# Altium schematic sheet SH21 - JTAG CONNECTOR.SchDoc
size 386 x 246 mm
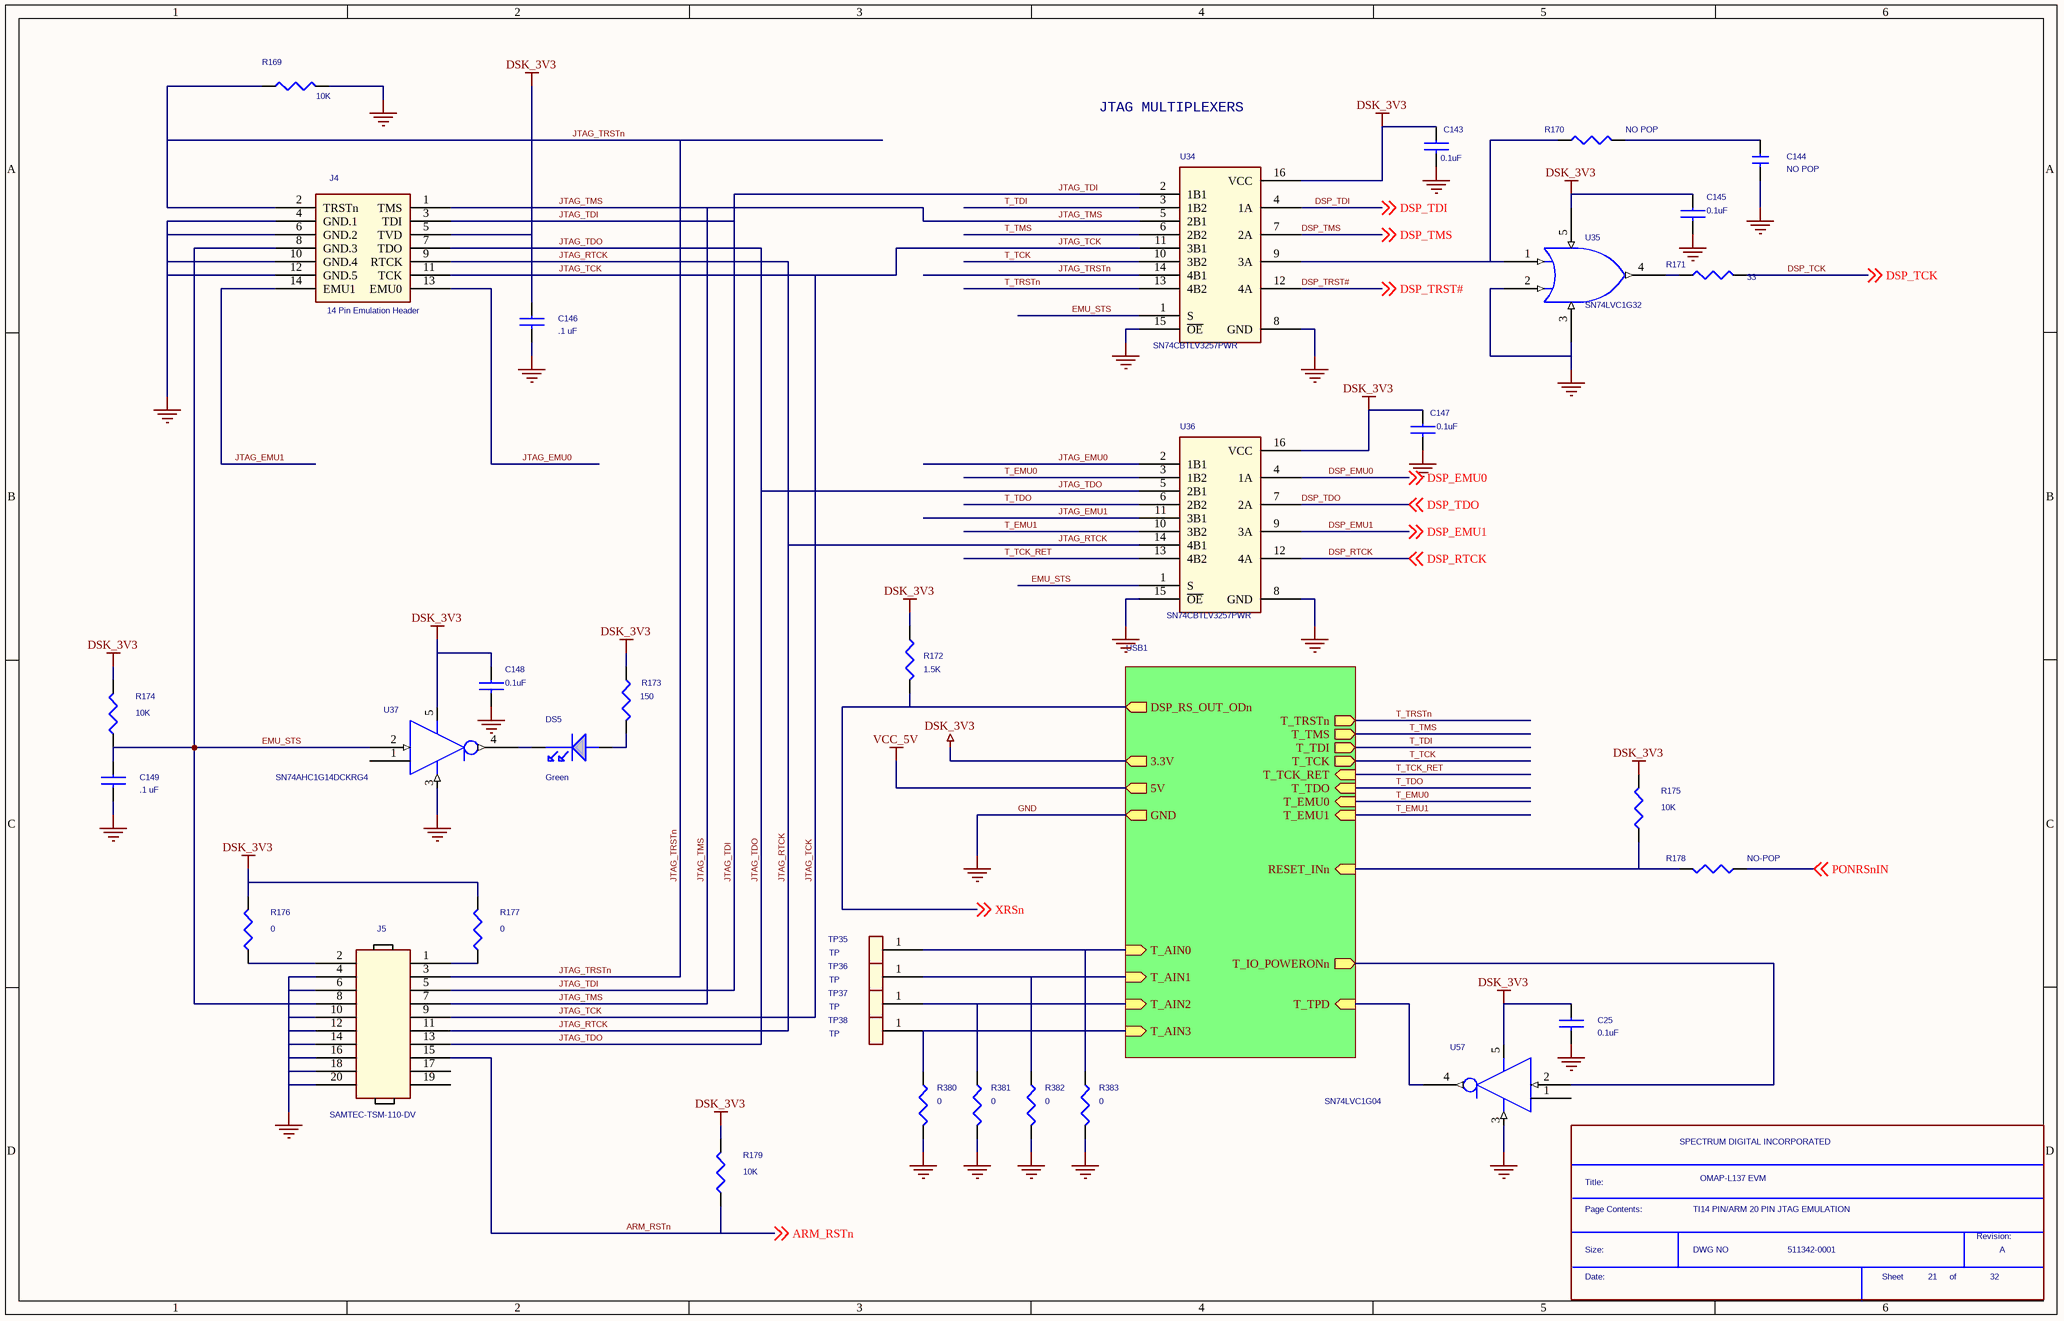
[diagram p0: SH21 - JTAG CONNECTOR.SchDoc]

## Parts
*  Page Contents:: TI14 PIN/ARM 20 PIN JTAG EMULATION  RevCode: A  Title: OMAP-L137 EVM  OrgName: SPECTRUM DIGITAL INCORPORATED  Doc: 511342-0001  Page Number: 21  Page Count: 32  (hidden comment: SDTitleBlock)  (graphical)
C25  0.1uF  [c402-25]
C143  0.1uF  [c402-25]
C144  NO POP  [c402-25]
C145  0.1uF  [c402-25]
C146  .1 uF  [c402-25]
C147  0.1uF  [c402-25]
C148  0.1uF  [c402-25]
C149  .1 uF  [c402-25]
DS5  Green  [CHIP 1206]
J4  14 Pin Emulation Header  [JUMP2X7-6040]
J5  SAMTEC-TSM-110-DV  [JUMP2X10-6040]
R169  10K  [r402-25]
R170  NO POP  [r603-35X45]
R171  33  [r402-25]
R172  1.5K  [r603-35x45]
R173  150  [r603-35x45]
R174  10K  [r402-25]
R175  10K  [r402-25]
R176  0  [r402-25]
R177  0  [r402-25]
R178  NO-POP  [r402-25]
R179  10K  [r402-25]
R380  0  [r402-25]
R381  0  [r402-25]
R382  0  [r402-25]
R383  0  [r402-25]
TP35  TP  [tp1-6040]
TP36  TP  [tp1-6040]
TP37  TP  [tp1-6040]
TP38  TP  [tp1-6040]
U34  SN74CBTLV3257PWR  [TSSOP 16]
U35  SN74LVC1G32  [SO5]
U36  SN74CBTLV3257PWR  [TSSOP 16]
U37  SN74AHC1G14DCKRG4  [DCK]
U57  SN74LVC1G04  [DCK]

## Sub-sheets
USB1 = ?: GND (out), 3.3V (out), T_TCK_RET (in), T_TCK (out), T_TMS (out), T_TDI (out), T_TDO (in), T_EMU0 (in), T_EMU1 (in), T_TRSTn (out), DSP_RS_OUT_ODn (out), RESET_INn (in), 5V (out), T_IO_POWERONn (out), T_TPD (in), T_AIN0 (in), T_AIN1 (in), T_AIN2 (in), T_AIN3 (in)

## Nets
DSK_3V3: C25.1 C143.1 C145.1 C146.1 C147.1 C148.1 J4.5(TVD) R172.1 R173.1 R174.2 R175.2 R176.2 R177.2 R179.2 U34.16(VCC) U35.5(VCC) U36.16(VCC) U37.5(VCC) U57.5(VCC) ; sheet USB1/3.3V
GND: C25.2 C143.2 C144.2 C145.2 C146.2 C147.2 C148.2 C149.2 J4.4(GND.1) J4.6(GND.2) J4.10(GND.4) J4.12(GND.5) J5.4 J5.6 J5.10 J5.12 J5.14 J5.16 J5.18 J5.20 R169.2 R380.2 R381.2 R382.2 R383.2 U34.8(GND) U34.15(~{OE}) U35.2(A) U35.3(GND) U36.8(GND) U36.15(~{OE}) U37.3(GND) U57.3(GND) ; sheet USB1/GND
VCC_5V: sheet USB1/5V
ARM_RSTn: J5.15 R179.1 ; off-sheet ARM_RSTn
DSP_EMU0: U36.4(1A) ; off-sheet DSP_EMU0
DSP_EMU1: U36.9(3A) ; off-sheet DSP_EMU1
DSP_RTCK: U36.12(4A) ; off-sheet DSP_RTCK
DSP_TCK: R171.1 ; off-sheet DSP_TCK
DSP_TDI: U34.4(1A) ; off-sheet DSP_TDI
DSP_TDO: U36.7(2A) ; off-sheet DSP_TDO
DSP_TMS: U34.7(2A) ; off-sheet DSP_TMS
DSP_TRST#: U34.12(4A) ; off-sheet DSP_TRST#
EMU_STS: C149.1 J4.8(GND.3) J5.8 R174.1 U34.1(S) U36.1(S) U37.2(I)
JTAG_EMU0: J4.13(EMU0) U36.2(1B1)
JTAG_EMU1: J4.14(EMU1) U36.11(3B1)
JTAG_RTCK: J4.9(RTCK) J5.11 U36.14(4B1)
JTAG_TCK: J4.11(TCK) J5.9 U34.11(3B1)
JTAG_TDI: J4.3(TDI) J5.5 U34.2(1B1)
JTAG_TDO: J4.7(TDO) J5.13 U36.5(2B1)
JTAG_TMS: J4.1(TMS) J5.7 U34.5(2B1)
JTAG_TRSTn: J4.2(TRSTn) J5.3 R169.1 U34.14(4B1)
PONRSnIN: R178.1 ; off-sheet PONRSnIN
T_EMU0: U36.3(1B2) ; sheet USB1/T_EMU0
T_EMU1: U36.10(3B2) ; sheet USB1/T_EMU1
T_TCK: U34.10(3B2) ; sheet USB1/T_TCK
T_TCK_RET: U36.13(4B2) ; sheet USB1/T_TCK_RET
T_TDI: U34.3(1B2) ; sheet USB1/T_TDI
T_TDO: U36.6(2B2) ; sheet USB1/T_TDO
T_TMS: U34.6(2B2) ; sheet USB1/T_TMS
T_TRSTn: U34.13(4B2) ; sheet USB1/T_TRSTn
XRSn: R172.2 ; off-sheet XRSn, sheet USB1/DSP_RS_OUT_ODn
NetC144_1: C144.1 R170.2
NetDS5_1: DS5.1(CATHODE) U37.4(O)
NetDS5_2: DS5.2(ANODE) R173.2
NetJ5_1: J5.1 R177.1
NetJ5_2: J5.2 R176.1
NetR170_1: R170.1 U34.9(3A) U35.1(B)
NetR171_2: R171.2 U35.4(Y)
NetR175_1: R175.1 R178.2 ; sheet USB1/RESET_INn
NetR380_1: R380.1 TP38.1 ; sheet USB1/T_AIN3
NetR381_1: R381.1 TP37.1 ; sheet USB1/T_AIN2
NetR382_1: R382.1 TP36.1 ; sheet USB1/T_AIN1
NetR383_1: R383.1 TP35.1 ; sheet USB1/T_AIN0
NetU57_2: U57.2(I) ; sheet USB1/T_IO_POWERONn
NetU57_4: U57.4(O) ; sheet USB1/T_TPD

Not connected (* = marked no-connect by the designer): J5 17 19; U37 1; U57 1

## Notes on the sheet
- JTAG MULTIPLEXERS
- (in symbol SDTitleBlock) Title:; Page Contents:; Revision:; Size:; DWG NO; Date:; Sheet; of

## Library data of the parts
C25 = CAP NP: Part #: 101587-1100R
C143 C145 C147 C148 = CAP NP_0: Capacitor, Ceramic, 16V, X7R, 10%; Part #: 101587-1100R
C144 = CAP NP_1: Part #: C0402-NOPOP
C146 C149 = CAP NP_0: Part #: 101587-1100R
DS5 = LED_1: LED, Green, SMT; Part #: 100823-0001R
J4 = 14 Pin Emulation Header_1: Part #: 100116-0007R
J5 = HEADER 10X2: Part #: 100116-0010R; TN: 224-0183-000
R169 R174 R175 R179 = RESISTOR_1: Part #: 101370-1003R
R170 = R: Part #: R0603-NOPOP
R171 = R_1: Resistor, 5%, 1/16W; Part #: 101370-3300R
R172 = RESISTOR_1: Part #: 100642-1502R
R173 = R_1: Resistor, 5%, 1/16W; Part #: 100687-1501R
R176 R177 R380-R383 = R: Part #: 101370-0001R
R178 = RESISTOR_1: Part #: R0402-NOPOP
TP35-TP38 = TEST POINT: Part #: 100115-0001R
U34 U36 = SN74CBT3257_0: IC, Quad 2-1 Multiplexer; Part #: 101670-0001R
U35 = 1G032_0: Part #: 101057-0032R
U37 = SN74LVC1GU04_0: Single Schmitt-Trigger Inverter Gate; Part #: 101027-0001R
U57 = SN74LVC1GU04_0: Part #: 101057-0004R